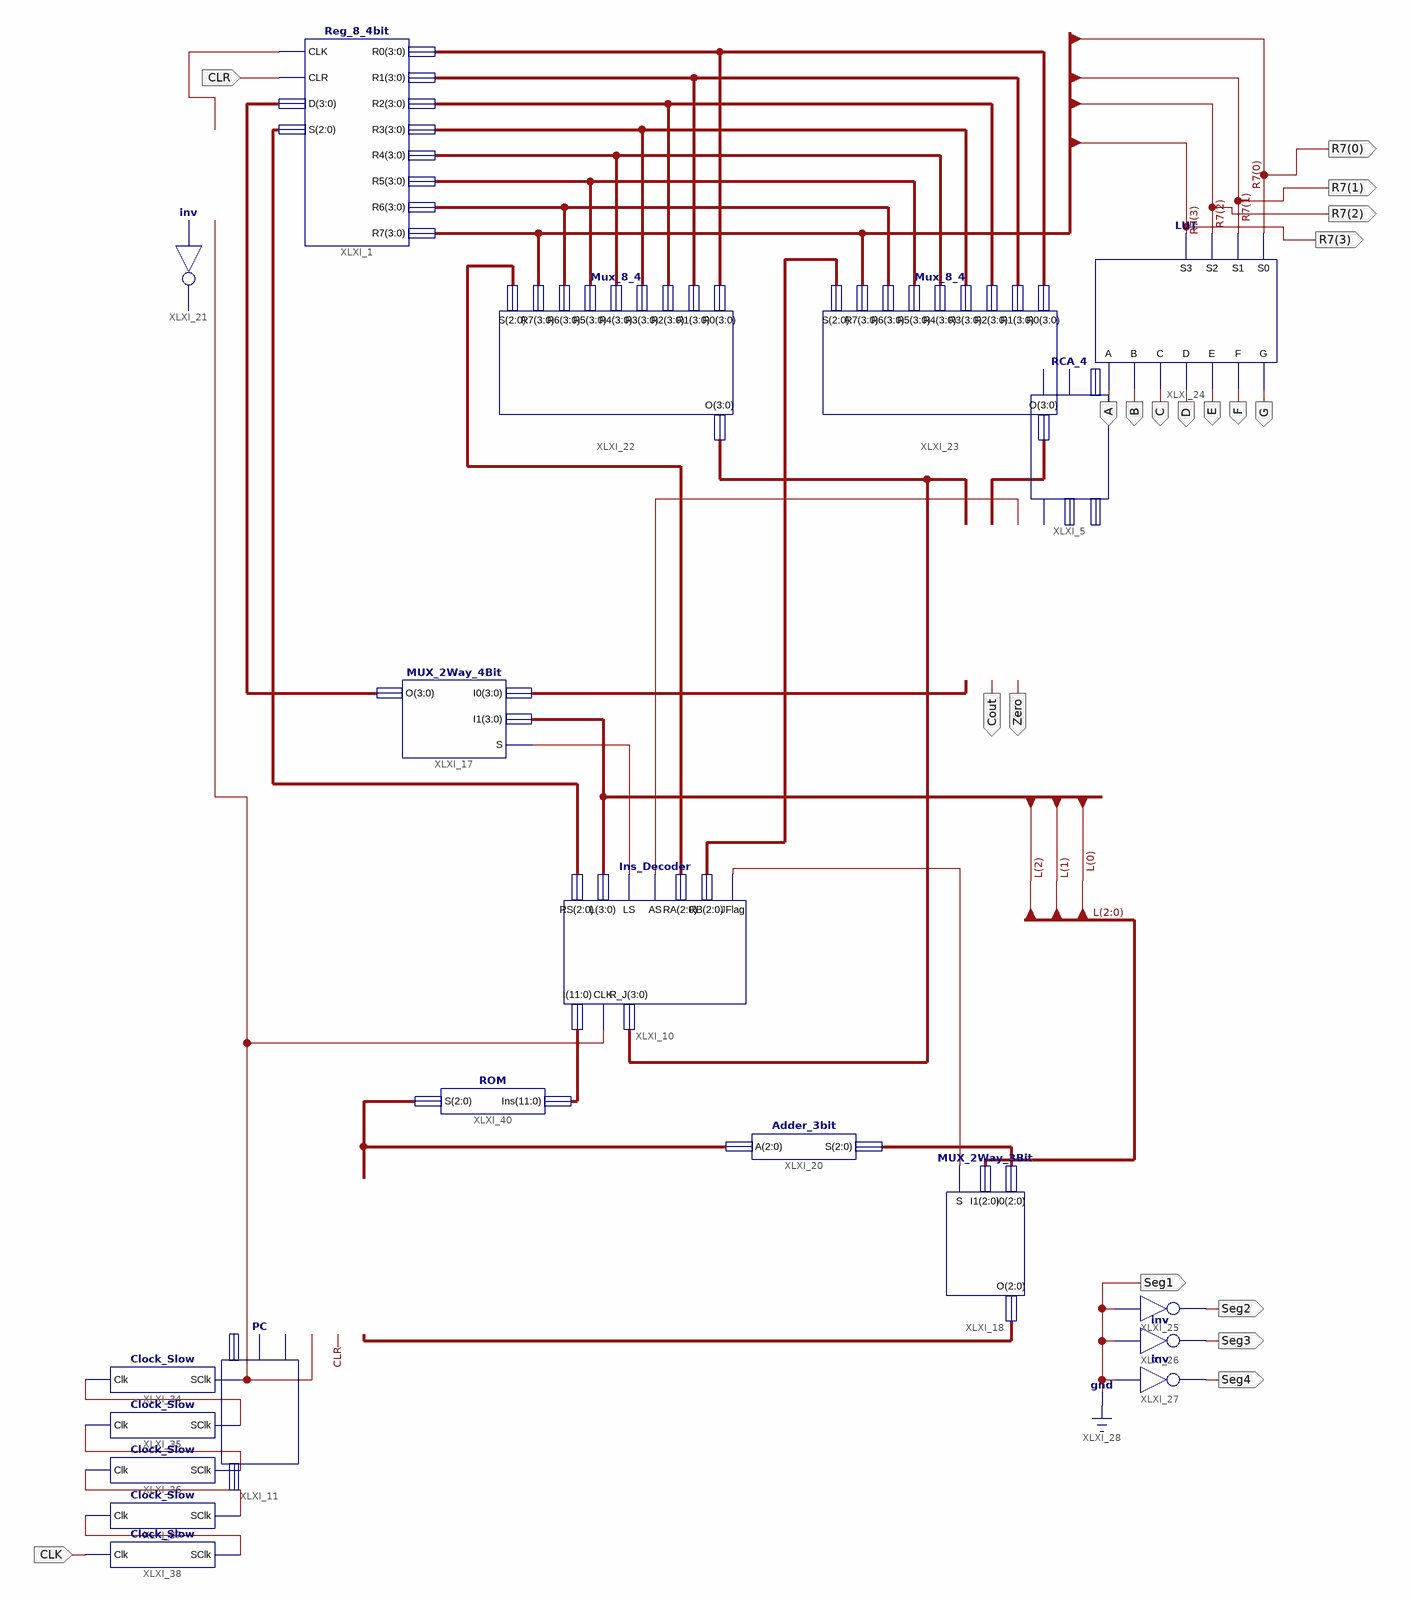
[diagram p0: schematic sheet 1]
// Xilinx ISE schematic Processor.sch (spartan3e) as structural Verilog: 20 symbols, 19 ports
module Processor (
  input  CLR,
  input  CLK,
  output Cout,
  output Zero,
  output [3:0] R7,
  output G,
  output F,
  output E,
  output D,
  output C,
  output B,
  output A,
  output Seg2,
  output Seg3,
  output Seg4,
  output Seg1
);

  wire SCLK, XLXN_12, XLXN_13, XLXN_16, XLXN_35, XLXN_106, XLXN_107, XLXN_108, XLXN_109;
  wire [2:0] PC, PC_Add, PC_In, R_En, RaE, RbE;
  wire [3:0] L, R0, R1, R2, R3, R5, R6, Ra, Rb, Result, XLXN_36, XLXN_110;
  wire [11:0] OpCode;

  Reg_8_4bit XLXI_1 (
    .CLK(XLXN_35), .CLR(CLR), .D(XLXN_36), .R0(R0), .R1(R1), .R2(R2), .R3(R3), .R4(XLXN_110), .R5(R5),
    .R6(R6), .R7(R7), .S(R_En));
  Ins_Decoder XLXI_10 (
    .AS(XLXN_13), .CLK(SCLK), .I(OpCode), .JFlag(XLXN_16), .L(L), .LS(XLXN_12), .RA(RaE), .RB(RbE),
    .RS(R_En), .R_J(Ra));
  RCA_4 XLXI_5 (.A(Ra), .AS(XLXN_13), .B(Rb), .C_out(Cout), .S(Result), .ZERO(Zero));
  PC XLXI_11 (.CLK(SCLK), .CLR(CLR), .D(PC_In), .S(PC));
  MUX_2Way_4Bit XLXI_17 (.I0(Result), .I1(L), .O(XLXN_36), .S(XLXN_12));
  MUX_2Way_3Bit XLXI_18 (.I0(PC_Add), .I1(L[2:0]), .O(PC_In), .S(XLXN_16));
  Adder_3bit XLXI_20 (.A(PC), .S(PC_Add));
  not XLXI_21 (XLXN_35, SCLK);
  Mux_8_4 XLXI_22 (.O(Ra), .R0(R0), .R1(R1), .R2(R2), .R3(R3), .R4(XLXN_110), .R5(R5), .R6(R6), .R7(R7), .S(RaE));
  Mux_8_4 XLXI_23 (.O(Rb), .R0(R0), .R1(R1), .R2(R2), .R3(R3), .R4(XLXN_110), .R5(R5), .R6(R6), .R7(R7), .S(RbE));
  LUT XLXI_24 (.A(A), .B(B), .C(C), .D(D), .E(E), .F(F), .G(G), .S0(R7[0]), .S1(R7[1]), .S2(R7[2]), .S3(R7[3]));
  not XLXI_25 (Seg2, 1'b0);
  not XLXI_26 (Seg3, 1'b0);
  not XLXI_27 (Seg4, 1'b0);
  Clock_Slow XLXI_34 (.Clk(XLXN_106), .SClk(SCLK));
  Clock_Slow XLXI_35 (.Clk(XLXN_107), .SClk(XLXN_106));
  Clock_Slow XLXI_36 (.Clk(XLXN_108), .SClk(XLXN_107));
  Clock_Slow XLXI_37 (.Clk(XLXN_109), .SClk(XLXN_108));
  Clock_Slow XLXI_38 (.Clk(CLK), .SClk(XLXN_109));
  ROM XLXI_40 (.Ins(OpCode), .S(PC));

  assign Seg1 = 1'b0;
endmodule
